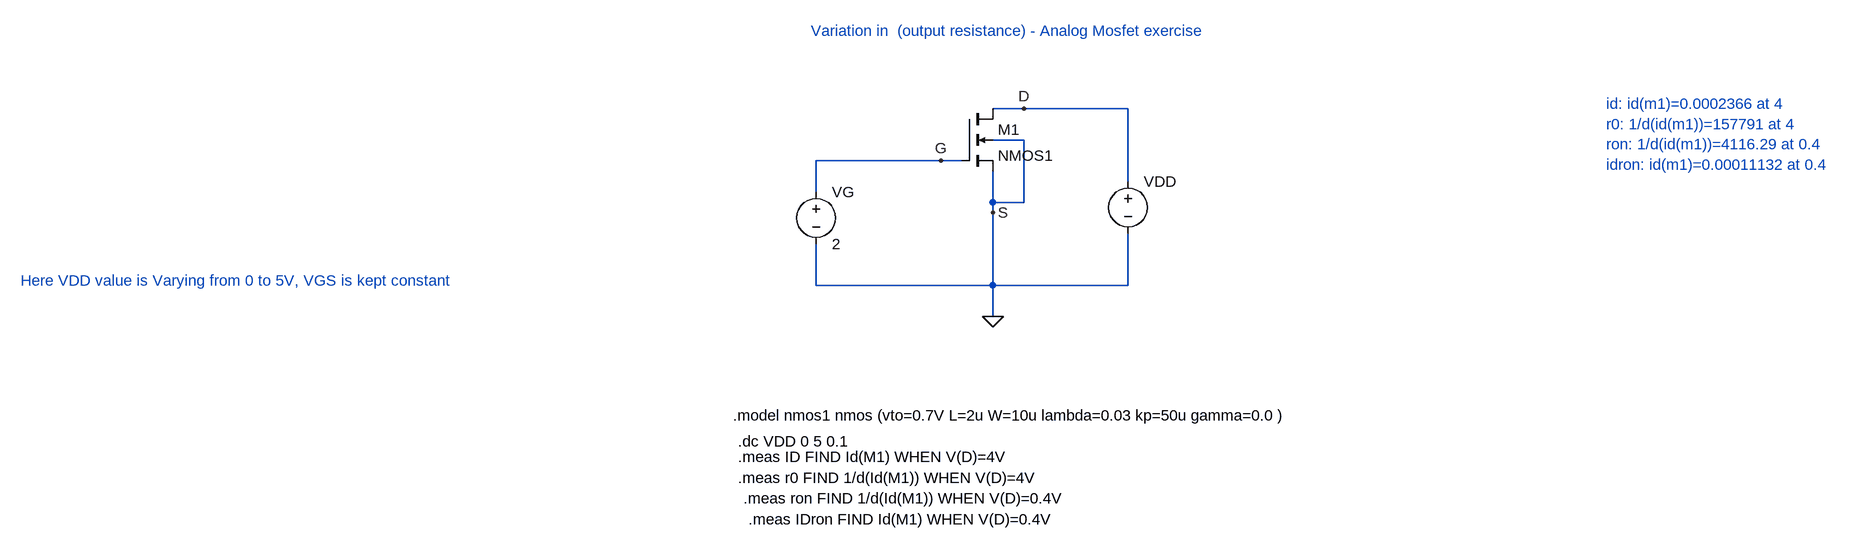
[diagram p0: schematic Variation in ro (mosfet) diff lambda.asc]
Variation in ro (mosfet) diff lambda.asc, the LTspice schematic file:
Version 4
SHEET 1 1700 784
WIRE 224 96 176 96
WIRE 384 96 224 96
WIRE 224 144 176 144
WIRE 96 176 -96 176
WIRE 128 176 96 176
WIRE 384 208 384 96
WIRE -96 224 -96 176
WIRE 176 240 176 192
WIRE 224 240 224 144
WIRE 224 240 176 240
WIRE 176 256 176 240
WIRE -96 368 -96 304
WIRE 176 368 176 256
WIRE 176 368 -96 368
WIRE 384 368 384 288
WIRE 384 368 176 368
WIRE 176 416 176 368
FLAG 176 416 0
FLAG 96 176 G
FLAG 224 96 D
FLAG 176 256 S
SYMBOL nmos4 128 96 R0
SYMATTR InstName M1
SYMATTR Value NMOS1
SYMBOL voltage -96 208 R0
WINDOW 123 0 0 Left 0
WINDOW 39 0 0 Left 0
SYMATTR InstName VG
SYMATTR Value 2
SYMBOL voltage 384 192 R0
WINDOW 123 0 0 Left 0
WINDOW 39 0 0 Left 0
SYMATTR InstName VDD
SYMATTR Value ""
TEXT -104 -24 Left 2 ;Variation in  (output resistance) - Analog Mosfet exercise
TEXT -224 568 Left 2 !.model nmos1 nmos (vto=0.7V L=2u W=10u lambda=0.03 kp=50u gamma=0.0 )
TEXT -216 608 Left 2 !.dc VDD 0 5 0.1
TEXT -216 632 Left 2 !.meas ID FIND Id(M1) WHEN V(D)=4V
TEXT -216 664 Left 2 !.meas r0 FIND 1/d(Id(M1)) WHEN V(D)=4V
TEXT -208 696 Left 2 !.meas ron FIND 1/d(Id(M1)) WHEN V(D)=0.4V
TEXT -200 728 Left 2 !.meas IDron FIND Id(M1) WHEN V(D)=0.4V
TEXT -1320 360 Left 2 ;Here VDD value is Varying from 0 to 5V, VGS is kept constant
TEXT 1120 88 Left 2 ;id: id(m1)=0.0002366 at 4\nr0: 1/d(id(m1))=157791 at 4\nron: 1/d(id(m1))=4116.29 at 0.4\nidron: id(m1)=0.00011132 at 0.4

The netlist it stands for:
* Variation in ro (mosfet) diff lambda.asc
M1 D G 0 0 NMOS1
VG G 0 2
VDD D 0
.model NMOS NMOS
.model PMOS PMOS
.lib standard.mos
* Variation in  (output resistance) - Analog Mosfet exercise
.model nmos1 nmos (vto=0.7V L=2u W=10u lambda=0.03 kp=50u gamma=0.0 )
.dc VDD 0 5 0.1
.meas ID FIND Id(M1) WHEN V(D)=4V
.meas r0 FIND 1/d(Id(M1)) WHEN V(D)=4V
.meas ron FIND 1/d(Id(M1)) WHEN V(D)=0.4V
.meas IDron FIND Id(M1) WHEN V(D)=0.4V
* Here VDD value is Varying from 0 to 5V, VGS is kept constant
* id: id(m1)=0.0002366 at 4
* r0: 1/d(id(m1))=157791 at 4
* ron: 1/d(id(m1))=4116.29 at 0.4
* idron: id(m1)=0.00011132 at 0.4
.backanno
.end

* Results of the author's LTspice run, read from the files saved beside the schematic
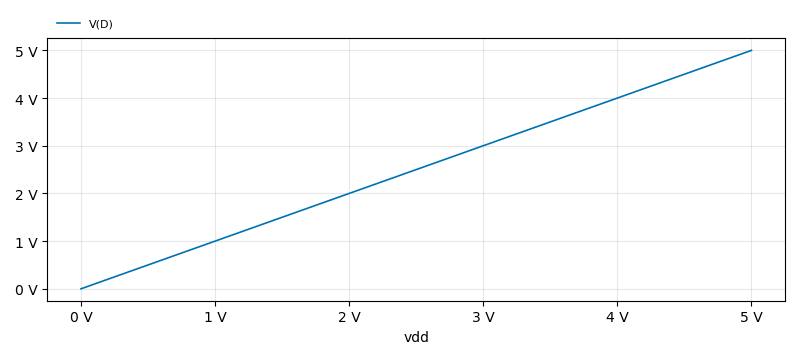
[diagram p1: DC transfer characteristic of Variation in ro (mosfet) diff lambda.asc, plotted from the saved traces]
* DC transfer characteristic, 1 run:
*   V(D): 0 V at vdd=0 V, 5 V at vdd=5 V, min 0 V, max 5 V
* From the log:
*   id: id(m1)=0.0002366 at 4
*   r0: 1/d(id(m1))=157791 at 4
*   ron: 1/d(id(m1))=4116.29 at 0.4
*   idron: id(m1)=0.00011132 at 0.4